# EAGLE design qtip_rev2 (EAGLE 9.3.1)
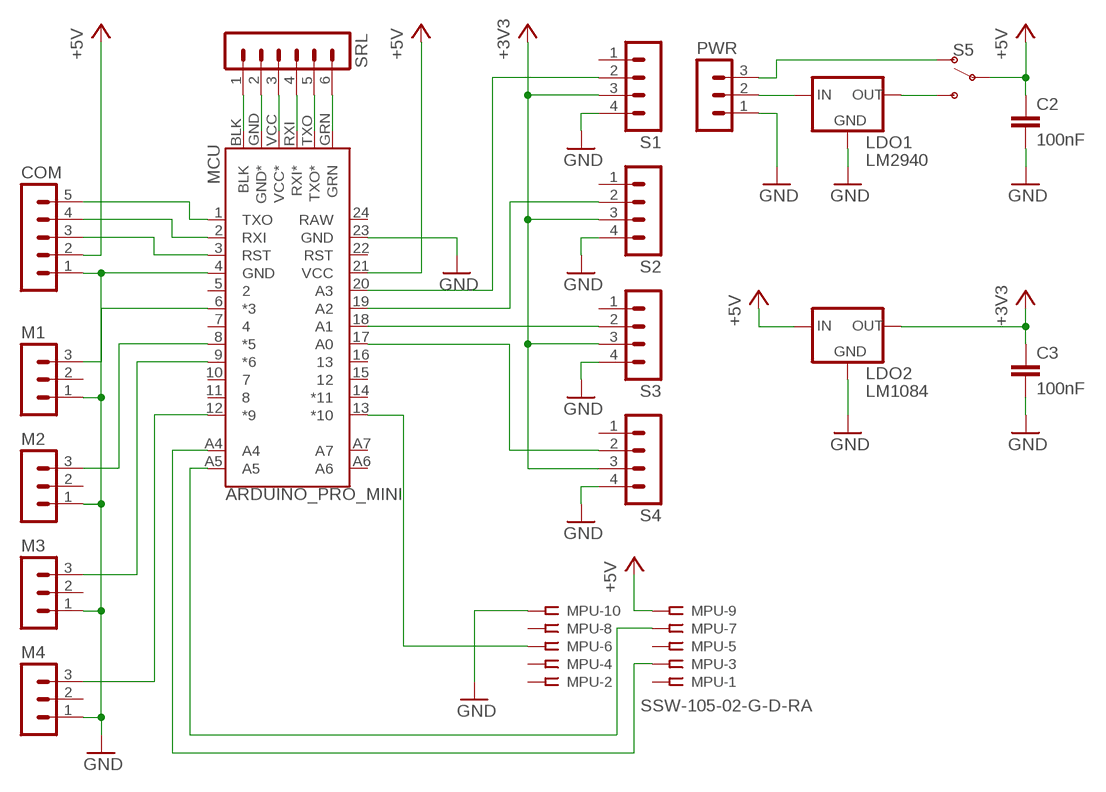
[diagram p0: schematic, sheet 1]

## Parts
C2  100nF  C-EU025-024X044  [C025-024X044]
C3  100nF  C-EU025-024X044  [C025-024X044]
COM  MA05-1  [MA05-1]
LDO1  LM2940  V_REG_LD1117VXX  [78XXL]
LDO2  LM1084  V_REG_LD1117VXX  [78XXL]
M1  MA03-1  [MA03-1]
M2  MA03-1  [MA03-1]
M3  MA03-1  [MA03-1]
M4  MA03-1  [MA03-1]
MCU  ARDUINO_PRO_MINI  [ARDUINO_PRO_MINI]
MPU  SSW-105-02-G-D-RA  [SSW-105-02-G-D-RA]
PWR  MA03-1  [MA03-1]
S1  MA04-1  [MA04-1]
S2  MA04-1  [MA04-1]
S3  MA04-1  [MA04-1]
S4  MA04-1  [MA04-1]
S5  SWITCH-SPDT-PTH-11.6X4.0MM  [SWITCH_SPDT_PTH_11.6X4.0MM]
SRL  MA06-1  [MA06-1]

## Nets
+3V3: C3.1 LDO2.GND(OUT) S1.3 S2.3 S3.3 S4.3
+5V: C2.1 COM.2 LDO2.OUT(IN) MCU.21(VCC) MPU.9 S5.2(P)
GND: C2.2 C3.2 COM.1 LDO1.IN(GND) LDO2.IN(GND) M1.1 M2.1 M3.1 M4.1 MCU.4(GND) MCU.23(GND) MPU.10 PWR.1 S1.4 S2.4 S3.4 S4.4
MV2: M2.3 MCU.8(*5)
N$1: MCU.A5 MPU.7
N$2: MCU.A4 MPU.3
N$3: MCU.20(A3) S1.2
N$4: MCU.13(*10) MPU.6
N$5: MCU.17(A0) S4.2
N$6: M1.3 MCU.6(*3)
N$7: M4.3 MCU.12(*9)
N$8: M3.3 MCU.9(*6)
N$9: LDO1.OUT(IN) PWR.2
N$10: MCU.BLK SRL.1
N$11: COM.5 MCU.1(TXO)
N$12: COM.4 MCU.2(RXI)
N$13: COM.3 MCU.3(RST)
N$14: MCU.GND(GND*) SRL.2
N$15: MCU.18(A1) S3.2
N$16: MCU.VCC(VCC*) SRL.3
N$17: MCU.19(A2) S2.2
N$18: MCU.RXI(RXI*) SRL.4
N$19: LDO1.GND(OUT) S5.3(S)
N$20: MCU.TXO(TXO*) SRL.5
N$21: PWR.3 S5.1(O)
N$22: MCU.GRN SRL.6
Unconnected: M1.2 M2.2 M3.2 M4.2 MCU.5 MCU.7 MCU.10 MCU.11 MCU.14(*11) MCU.15 MCU.16 MCU.22(RST) MCU.A6 MCU.A7 MPU.1 MPU.2 MPU.4 MPU.5 MPU.8 S1.1 S2.1 S3.1 S4.1

## Power pins joined to a net without a drawn wire
RAW: MCU.24(RAW)

## Library data of the parts
C2 C3 = rcl:C-EU: CAPACITOR, European symbol; SPICEPREFIX: C
COM = con-lstb:MA05-1: PIN HEADER; OC_FARNELL: unknown; OC_NEWARK: unknown; SPICEPREFIX: X
LDO1 LDO2 = SparkFun-IC-Power:V_REG_LD1117VXX: LD1117VXX voltage regulator. We carry the 3.3V version (COM-00526) in TO-220 package.
M1-M4 PWR = con-lstb:MA03-1: PIN HEADER; OC_FARNELL: unknown; OC_NEWARK: unknown
MCU = SparkFun-Boards_rev2:ARDUINO_PRO_MINI: SparkFun Pro Mini Pro Mini compatible footprint. Dimensions: 0.7 x 1.3" PCB Thickness: 0.8mm SparkFun Products: 3.3V/8MHz <https://www.sparkfun.com/products/11114> 5V/16MHz <https://www.sparkfun.com/products/11113>
MPU = con-samtec:SSW-105-02-G: THROUGH-HOLE .025" SQ POST SOCKET Source: Samtec SSW.pdf; MF: Samtec Inc.; MPN: SSW-105-02-G-D-RA; OC_FARNELL: unknown; OC_NEWARK: 18M6953
S1-S4 = con-lstb:MA04-1: PIN HEADER; OC_FARNELL: unknown; OC_NEWARK: unknown
S5 = sparkfun-switch_rev2:SWITCH-SPDT: Single Pole, Double Throw (SPDT) Switch Single-pole, double-throw (SPDT) switch. Variant Overview SMD-AYZ0202 Surface Mount DPDT Switch <https://www.sparkfun.com/products/597> (COM-00597) Used on e.g. LilyPad Arduino USB - ATmega32U4 Board <https://www.sparkfun.com/products/12049> PTH-11.6X4.0MM SPDT Mini Power Switch <https://www.sparkfun.com/products/102> (COM-00102) Used on e.g. SparkFun Simon Says - Through-Hole Soldering Kit <https://www.sparkfun.com/products/10547> (KIT-10547) PTH-11.6X4.0MM-KIT KIT version of SPDT Mini Power Switch - Simplifies soldering by removing tStop of switch pins - only one side can be soldered. PTH-11.6X4.0MM-LOCK LOCK version of SPDT Mini Power Switch - Offset pins hold switch in place for easier soldering. SMD-RIGHT-ANGLE Surface Mount Right Angle Switch <https://www.sparkfun.com/products/10860> (COM-10860) Used on e.g. SparkFun ESP8266 Thing <https://www.sparkfun.com/products/13231>; PROD_ID: SWCH-08261; SF_SKU: COM-00102
SRL = new_lstb:MA06-1: PIN HEADER; OC_FARNELL: unknown; OC_NEWARK: unknown

## Net classes
0 default: width 0.203 mm

## Board
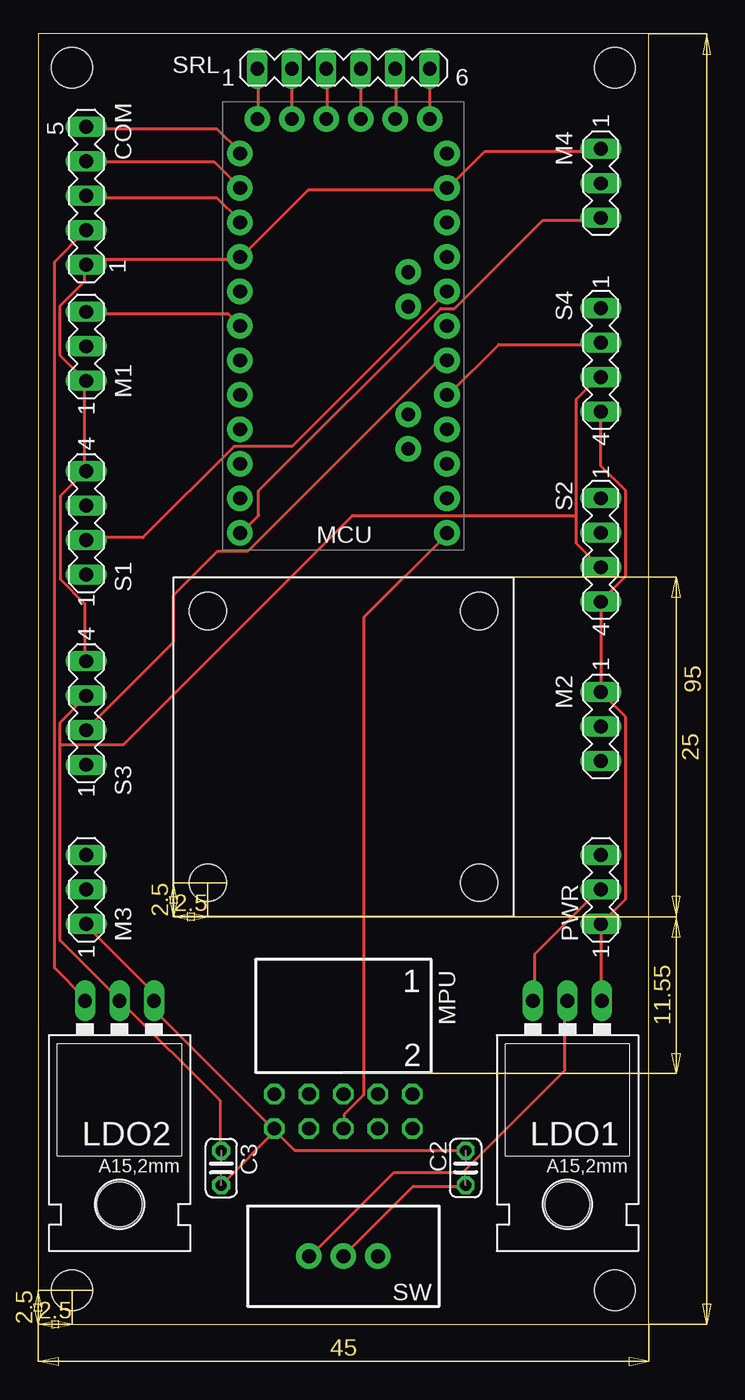
[diagram p1: board, top side]
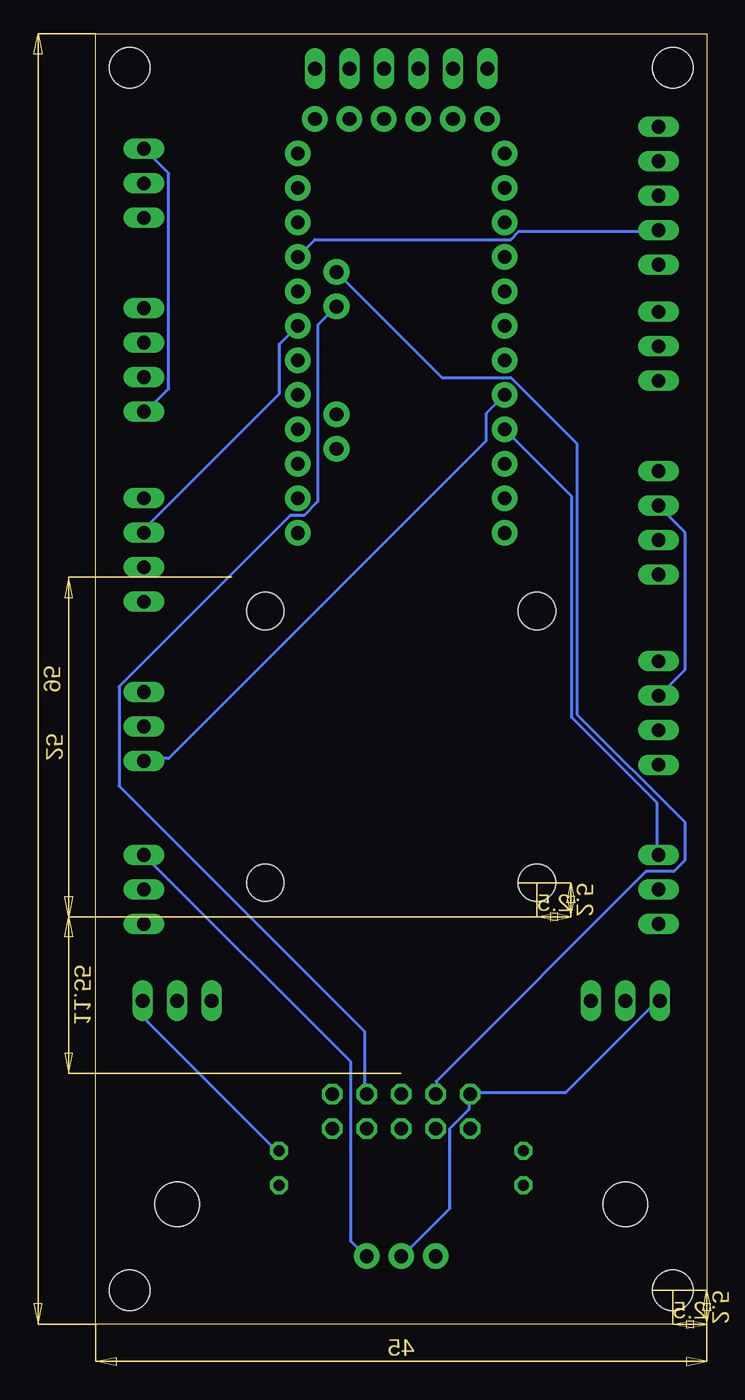
[diagram p2: board, bottom side, seen from below]

Size 45 x 95 mm. Coordinates in mm from the lower left corner, seen from the top.
Outline: 0,0 45,0 45,95 0,95 0,0
Copper layers (1*16): Top 0.035mm / dielectric 1.5mm / Bottom 0.035mm
Design rules "default": minimum track width 6mil, minimum drill 0.35mm, track to track 6mil, track to pad 6mil, pad to pad 6mil, via to via 6mil, smd to smd 6mil, copper to edge 40mil, drill to drill 6mil, minimum pad ring 10mil, minimum via ring 8mil, stop-mask expansion 4mil, vias tented up to drill 0mil, thermal gap 10mil
Holes 3 mm at 2.5,2.5 42.5,2.5 2.5,92.5 42.5,92.5
Holes 2.75 mm at 12.5,52.5 32.5,52.5 32.5,32.5 12.5,32.5

### Footprints (pad centres in the part's own frame; a part is rotated, then mirrored left to right if it is on the bottom)
C025-024X044 = drill 0.813 octagon: 1 -1.27,0; 2 1.27,0
MA05-1 = drill 1.016 long: 1 -5.08,0; 2 -2.54,0; 3 0,0; 4 2.54,0; 5 5.08,0
78XXL = drill 1.016 long: GND 0,-3.81; IN -2.54,-3.81; OUT 2.54,-3.81 | hole 3.302: 0,11.176
MA03-1 = drill 1.016 long: 1 -2.54,0; 2 0,0; 3 2.54,0
ARDUINO_PRO_MINI = drill 1.016 pad 1.88: 1 -7.62,12.7; 2 -7.62,10.16; 3 -7.62,7.62; 4 -7.62,5.08; 5 -7.62,2.54; 6 -7.62,0; 7 -7.62,-2.54; 8 -7.62,-5.08; 9 -7.62,-7.62; 10 -7.62,-10.16; 11 -7.62,-12.7; 12 -7.62,-15.24; 13 7.62,-15.24; 14 7.62,-12.7; 15 7.62,-10.16; 16 7.62,-7.62; 17 7.62,-5.08; 18 7.62,-2.54; 19 7.62,0; 20 7.62,2.54; 21 7.62,5.08; 22 7.62,7.62; 23 7.62,10.16; 24 7.62,12.7; A4 4.763,1.429; A5 4.763,3.969; A6 4.763,-9.049; A7 4.763,-6.509; BLK -6.35,15.24; GND -3.81,15.24; GRN 6.35,15.24; RXI 1.27,15.24; TXO 3.81,15.24; VCC -1.27,15.24
SSW-105-02-G-D-RA = drill 1 pad 1.5 octagon: 1 -5.08,1.524; 2 -5.08,4.064; 3 -2.54,1.524; 4 -2.54,4.064; 5 0,1.524; 6 0,4.064; 7 2.54,1.524; 8 2.54,4.064; 9 5.08,1.524; 10 5.08,4.064
MA04-1 = drill 1.016 long: 1 -3.81,0; 2 -1.27,0; 3 1.27,0; 4 3.81,0
SWITCH_SPDT_PTH_11.6X4.0MM = drill 1.016 pad 1.88: 1 0,2.54; 2 0,0; 3 0,-2.54
MA06-1 = drill 1.016 long: 1 -6.35,0; 2 -3.81,0; 3 -1.27,0; 4 1.27,0; 5 3.81,0; 6 6.35,0

### Placement (x,y rotation side)
C2  31.5,11.5 90 top
C3  13.5,11.5 270 top
COM  3.55,83.09 90 top
LDO1  39,20 180 top
LDO2  6,20 180 top
M1  3.55,72 90 top
M2  41.45,44 270 top
M3  3.55,32 90 top
M4  41.45,84 270 top
MCU  22.5,73.5 0 top
MPU  22.5,18.45 180 top
PWR  41.45,32 90 top
S1  3.55,59 90 top
S2  41.45,57 270 top
S3  3.55,45 90 top
S4  41.45,71 270 top
S5  22.5,5 270 top
SRL  22.5,92.45 0 top

### Tracks (layer width: path | path; a pad name or v marks a point on that pad's centre or on a via)
+3V3
  Top 0.203: 39.62,59.54 39.62,68.07 41.25,69.7 S4.3 | 39.62,59.54 39.62,57.51 41.25,55.88 S2.3 | C3.1 13.41,12.8 13.41,16.46 6.1,23.77 LDO2.GND 5.89,23.98 1.63,28.25 1.63,42.67 | 1.63,42.67 1.63,44.3 3.45,46.13 S3.3 | 39.62,59.54 23.16,59.54 6.3,42.67 1.63,42.67
  Bottom 0.203: S3.3 3.45,46.33 1.63,48.16 1.63,58.32 3.45,60.15 S1.3
+5V
  Top 0.203: C2.1 31.5,10.16 27.64,10.16 22.55,5.08 S5.2 | COM.2 3.45,80.47 1.22,78.23 1.22,26.21 3.45,23.98 LDO2.OUT
  Bottom 0.203: COM.2 3.66,80.47 13.82,80.47 14.43,79.86 28.85,79.86 30.07,78.64 MCU.21 | S5.2 22.35,5.08 18.9,8.53 18.9,14.43 17.48,15.85 17.48,16.87 MPU.9 17.27,17.07 10.36,17.07 3.66,23.77 LDO2.OUT
GND
  Top 0.203: M4.1 41.25,86.36 32.92,86.36 30.28,83.72 MCU.23 30.07,83.52 19.91,83.52 15.04,78.64 MCU.4 14.83,78.44 4.06,78.44 3.66,78.03 COM.1 3.45,77.83 3.45,76.81 1.63,74.98 1.63,71.32 3.45,69.49 M1.1 3.45,69.29 3.45,62.99 S1.4 3.45,62.79 1.63,60.96 1.63,54.86 3.45,53.03 3.45,48.97 S3.4 | S4.4 41.45,67.06 41.45,63.2 43.28,61.37 43.28,55.07 41.45,53.24 S2.4 41.45,53.03 41.45,46.74 M2.1 43.28,44.7 43.28,31.29 PWR.1 41.45,29.26 41.45,23.98 LDO1.IN | M3.1 3.66,29.26 8.53,24.38 8.53,23.98 LDO2.IN 8.74,23.77 8.74,22.96 17.27,14.43 MPU.10 17.48,14.22 | 17.48,14.22 13.61,10.36 C3.2 | 17.48,14.22 18.9,12.8 31.5,12.8 C2.2
  Bottom 0.203: LDO1.IN 41.45,23.77 41.45,22.55 31.7,12.8 C2.2 | M4.1 41.25,86.36 39.62,84.73 39.62,68.89 41.25,67.26 S4.4
MV2
  Bottom 0.203: M2.3 41.25,41.66 39.62,41.66 16.26,65.02 16.26,67.06 15.04,68.28 MCU.8
N$1
  Bottom 0.203: MPU.7 19.91,17.07 19.91,17.88 4.47,33.33 2.44,33.33 1.63,34.14 1.63,36.98 9.55,44.91 9.55,64.82 14.43,69.7 19.51,69.7 27.23,77.42 MCU.A5
N$2
  Bottom 0.203: MPU.3 25.2,17.07 25.2,21.54 43.28,39.62 43.28,46.94 30.68,59.54 29.67,59.54 28.65,60.55 28.65,73.56 27.43,74.78 MCU.A4
N$3
  Top 0.203: S1.2 3.66,57.91 7.72,57.91 14.43,64.62 18.69,64.62 30.07,76 MCU.20
N$4
  Top 0.203: MPU.6 22.55,14.43 22.55,15.44 23.98,16.87 23.98,52.02 30.07,58.12 MCU.13
N$5
  Top 0.203: S4.2 41.25,72.14 33.93,72.14 30.28,68.48 MCU.17
N$6
  Top 0.203: M1.3 3.66,74.37 14.02,74.37 14.83,73.56 MCU.6
N$7
  Top 0.203: M4.3 41.25,81.28 37.19,81.28 30.68,74.78 29.67,74.78 16.26,61.37 16.26,59.54 15.04,58.32 MCU.12
N$8
  Bottom 0.203: M3.3 3.66,34.54 3.66,38.41 9.96,44.7 9.96,60.96 14.83,65.84 MCU.9
N$9
  Top 0.203: LDO1.OUT 36.58,23.98 36.58,27.23 41.25,31.9 PWR.2
N$10
  Top 0.203: SRL.1 16.26,92.25 16.26,88.8 MCU.BLK
N$11
  Top 0.203: COM.5 3.66,87.99 13.21,87.99 14.83,86.36 MCU.1
N$12
  Top 0.203: COM.4 3.66,85.55 13.01,85.55 14.83,83.72 MCU.2
N$13
  Top 0.203: COM.3 3.66,82.91 13.21,82.91 14.83,81.28 MCU.3
N$14
  Top 0.203: SRL.2 18.69,92.25 18.69,88.8 MCU.GND
N$15
  Top 0.203: S3.2 3.66,43.89 9.96,50.19 9.96,53.65 13.21,56.9 15.44,56.9 29.46,70.92 30.07,70.92 MCU.18
N$16
  Top 0.203: SRL.3 21.34,92.25 21.34,88.8 MCU.VCC
N$17
  Bottom 0.203: S2.2 41.25,58.32 41.25,58.73 31.5,68.48 31.5,72.14 30.28,73.36 MCU.19
N$18
  Top 0.203: SRL.4 23.77,92.25 23.77,88.8 MCU.RXI
N$19
  Top 0.203: LDO1.GND 38.81,23.77 38.81,18.69 31.29,11.18 26.21,11.18 20.12,5.08 S5.3
N$20
  Top 0.203: SRL.5 26.42,92.25 26.42,88.8 MCU.TXO
N$21
  Bottom 0.203: PWR.3 41.25,34.34 26.21,19.3 26.21,6.1 25.2,5.08 S5.1
N$22
  Top 0.203: SRL.6 28.85,92.25 28.85,88.8 MCU.GRN

### Text on the board
tNames: MCU | SW